# Altium project ExtBoard 20Pin.PrjPcb
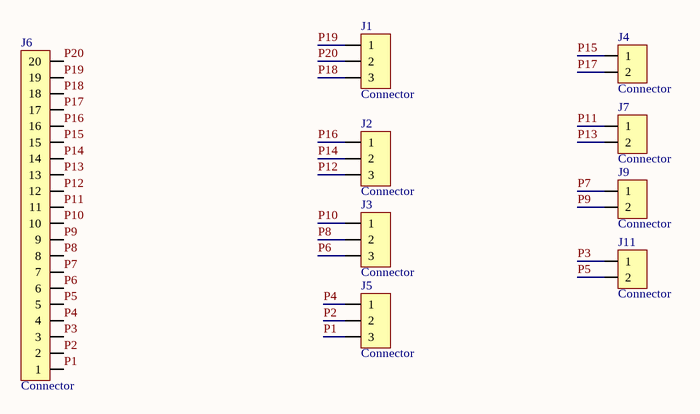
[diagram p0: ExtBoard 20Pin.SchDoc]
1 sheet, 9 parts. Net scope: global (net labels, ports and power ports of the same name join across sheets).
Board files: ExtBoard 20Pin.PcbDoc, ExtBoard 20Pin v2.PcbDoc

## Sheet ExtBoard 20Pin.SchDoc
size A4

### Parts
J1  Connector  [DG301 5mm 3p]
J2  Connector  [DG301 5mm 3p]
J3  Connector  [DG301 5mm 3p]
J4  Connector  [DG301 5mm 2p]
J5  Connector  [DG301 5mm 3p]
J6  Connector  [LINE 2.54 x 20D (2 x 10)]
J7  Connector  [DG301 5mm 2p]
J9  Connector  [DG301 5mm 2p]
J11  Connector  [DG301 5mm 2p]

### Nets
P1: J5.3 J6.1
P2: J5.2 J6.2
P3: J6.3 J11.1
P4: J5.1 J6.4
P5: J6.5 J11.2
P6: J3.3 J6.6
P7: J6.7 J9.1
P8: J3.2 J6.8
P9: J6.9 J9.2
P10: J3.1 J6.10
P11: J6.11 J7.1
P12: J2.3 J6.12
P13: J6.13 J7.2
P14: J2.2 J6.14
P15: J4.1 J6.15
P16: J2.1 J6.16
P17: J4.2 J6.17
P18: J1.3 J6.18
P19: J1.1 J6.19
P20: J1.2 J6.20

### Library data of the parts
J1-J3 J5 = DG301-5.0-3P12: DG301 series
J4 J7 J9 J11 = DG301-5.0-2P12: DG301 series
J6 = PLD-20 (2 x 10): Vert, Dbl line, Male